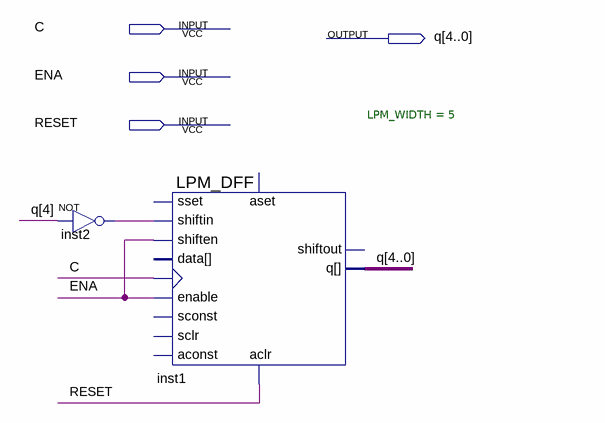
[diagram p0: schematic sheet]
// Quartus schematic johnson_counter.bdf as structural Verilog: 2 symbols, 4 pins
module johnson_counter (
  input  C,
  input  ENA,
  input  RESET,
  output [4:0] q
);

  wire inst2_out;

  not inst2 (inst2_out, q[4]);
  LPM_DFF #(.LPM_WIDTH(5)) inst1 (
    .shiftin(inst2_out), .shiften(ENA), .enable(ENA), .clock(C), .aclr(RESET), .q(q));  // open: data, aconst, sclr, sconst, sset, aset, shiftout
endmodule
